# EAGLE design Tuesday(MelodyR2-smtleds) (EAGLE 6.5.0)
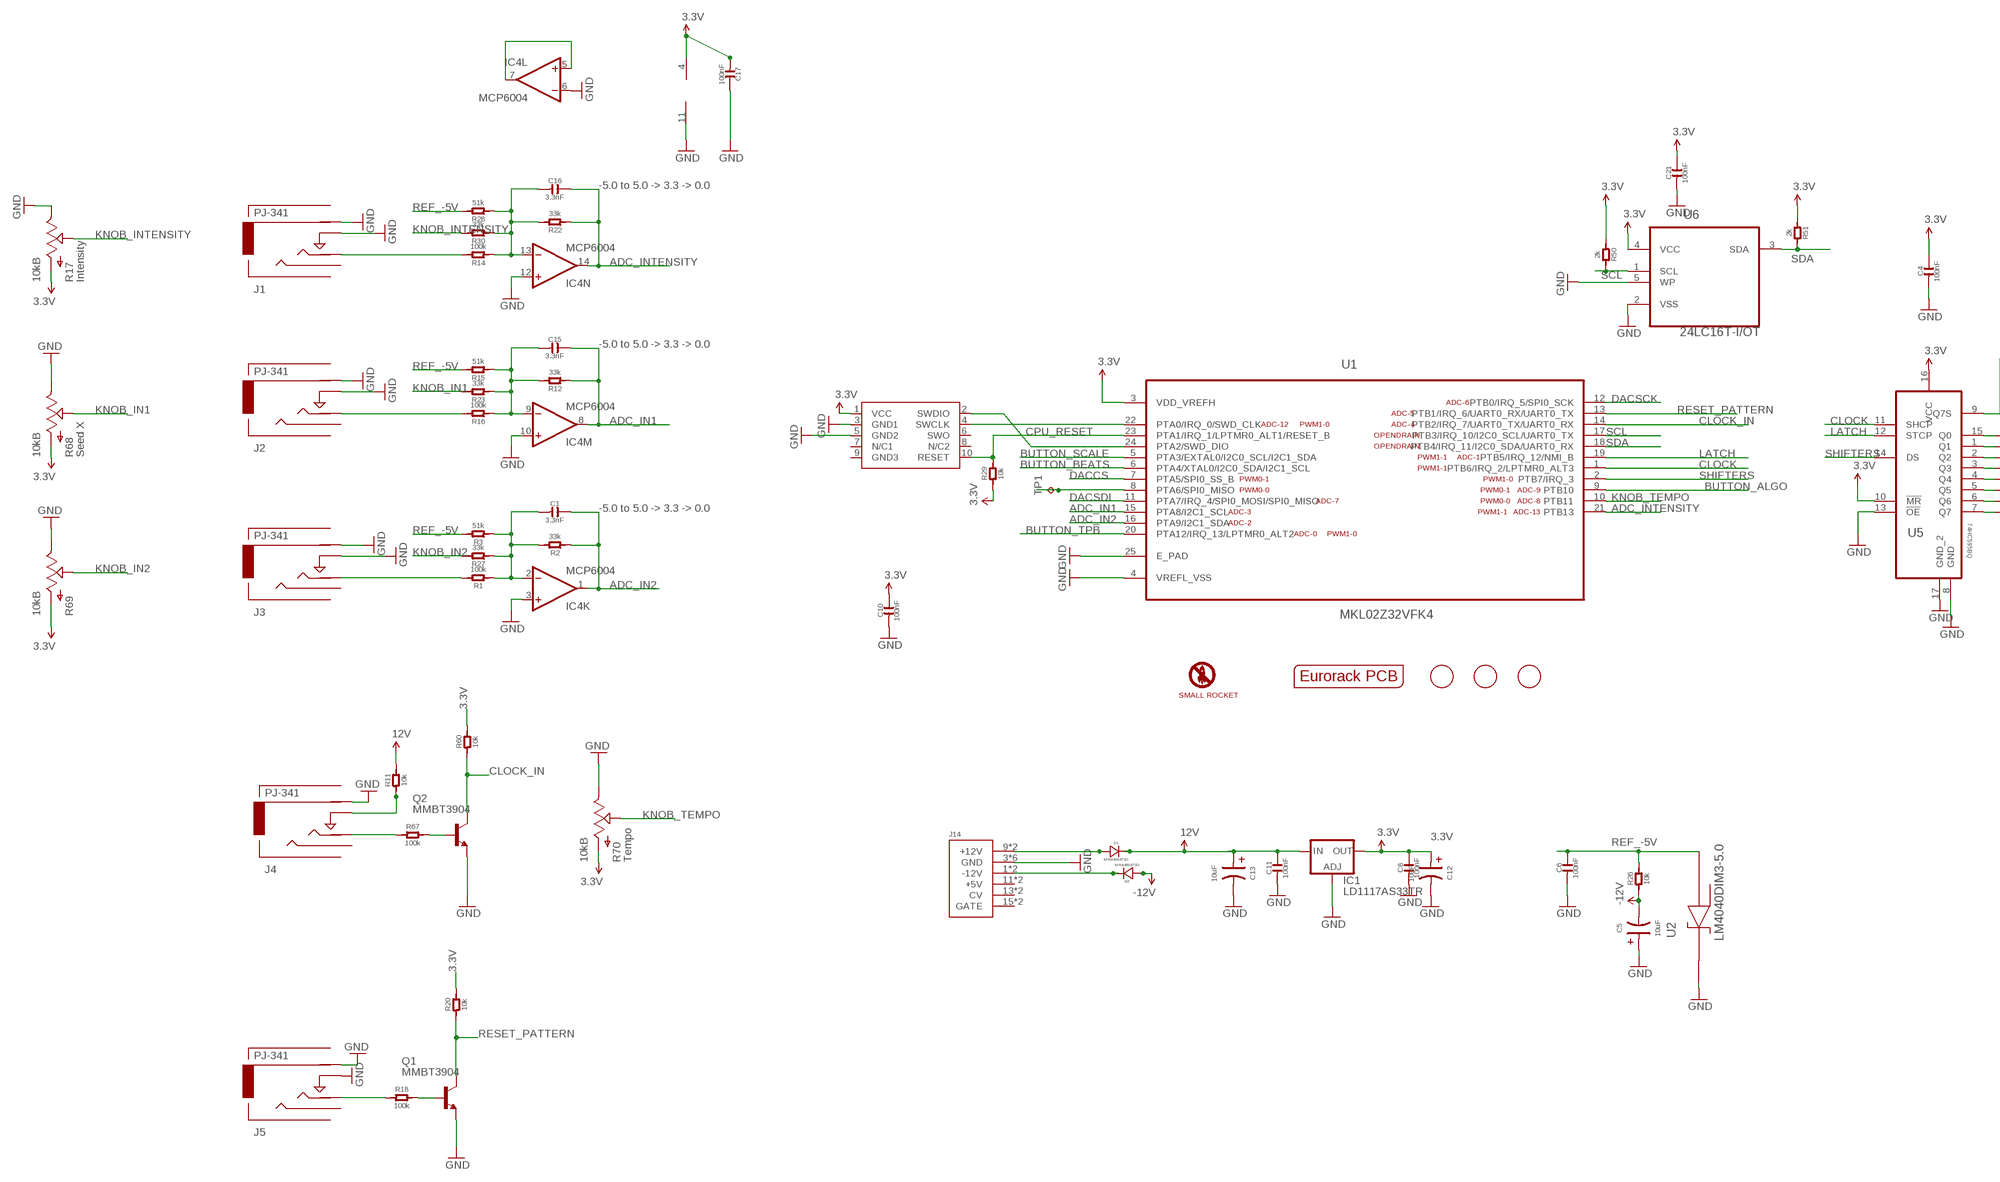
[diagram p0: schematic, sheet 1, part 1 of 2]
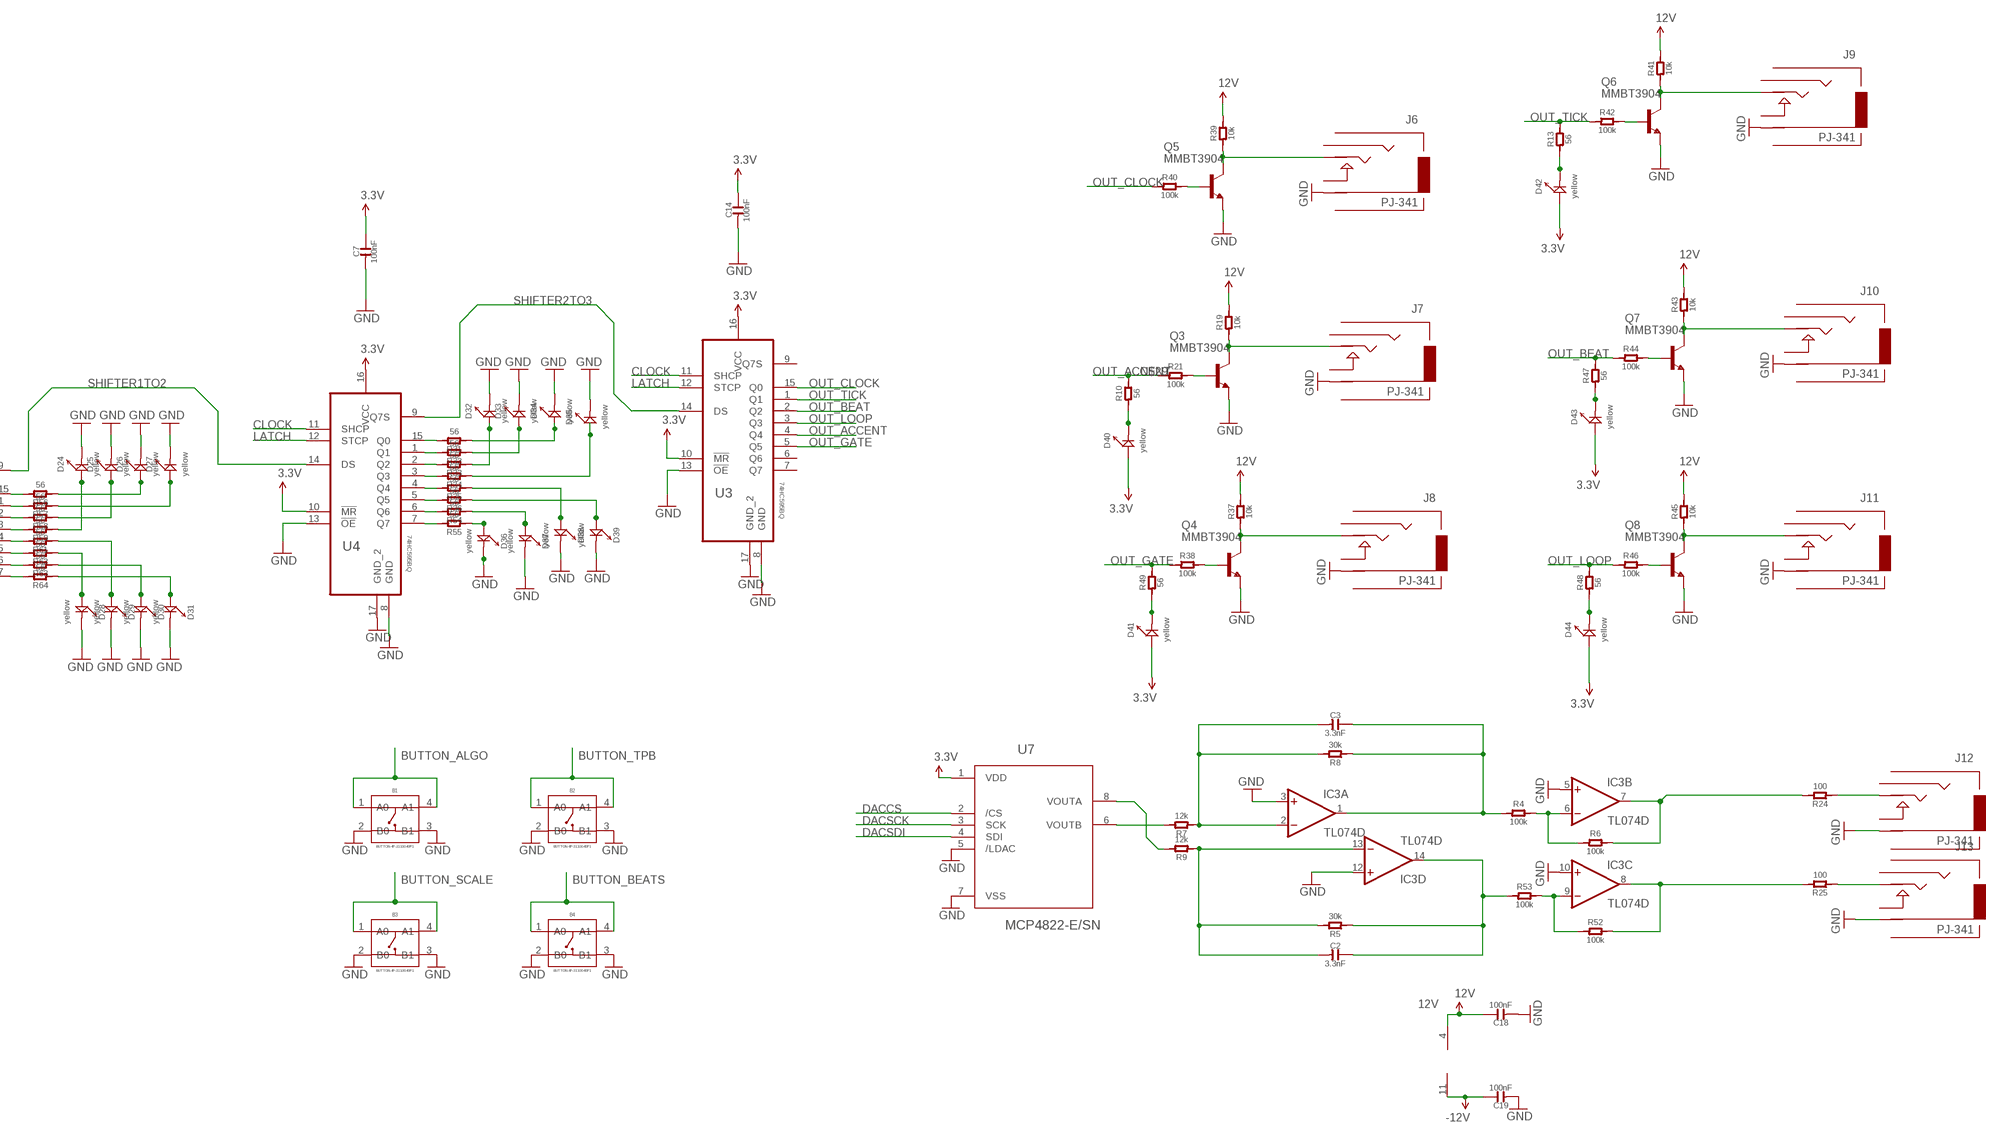
[diagram p1: schematic, sheet 1, part 2 of 2]

## Parts
B1  BUTTON-4P-3110040P1  [4P-6.0X6.0X5.0H]
B2  BUTTON-4P-3110040P1  [4P-6.0X6.0X5.0H]
B3  BUTTON-4P-3110040P1  [4P-6.0X6.0X5.0H]
B4  BUTTON-4P-3110040P1  [4P-6.0X6.0X5.0H]
C1  3.3nF  C-0603  [C0603]
C2  3.3nF  C-0603  [C0603]
C3  3.3nF  C-0603  [C0603]
C4  100nF  C-0603  [C0603]
C5  10uF  C-POLAR-A  [AVX-A]
C6  100nF  C-0603  [C0603]
C7  100nF  C-0603  [C0603]
C8  100nF  C-0603  [C0603]
C10  100nF  C-0603  [C0603]
C11  100nF  C-0603  [C0603]
C12  10uF  C-POLAR-A  [AVX-A]
C13  10uF  C-POLAR-A  [AVX-A]
C14  100nF  C-0603  [C0603]
C15  3.3nF  C-0603  [C0603]
C16  3.3nF  C-0603  [C0603]
C17  100nF  C-0603  [C0603]
C18  100nF  C-0603  [C0603]
C19  100nF  C-0603  [C0603]
C21  100nF  C-0603  [C0603]
D1  MRA4004T3G  D-SMA  [DO-214AC]
D2  MRA4004T3G  D-SMA  [DO-214AC]
D24  yellow  LED  [LED0603]
D25  yellow  LED  [LED0603]
D26  yellow  LED  [LED0603]
D27  yellow  LED  [LED0603]
D28  yellow  LED  [LED0603]
D29  yellow  LED  [LED0603]
D30  yellow  LED  [LED0603]
D31  yellow  LED  [LED0603]
D32  yellow  LED  [LED0603]
D33  yellow  LED  [LED0603]
D34  yellow  LED  [LED0603]
D35  yellow  LED  [LED0603]
D36  yellow  LED  [LED0603]
D37  yellow  LED  [LED0603]
D38  yellow  LED  [LED0603]
D39  yellow  LED  [LED0603]
D40  yellow  LED  [LED0603]
D41  yellow  LED  [LED0603]
D42  yellow  LED  [LED0603]
D43  yellow  LED  [LED0603]
D44  yellow  LED  [LED0603]
FID1  FIDUCIAL  [FIDUCIAL_1MM]
FID2  FIDUCIAL  [FIDUCIAL_1MM]
FID3  FIDUCIAL  [FIDUCIAL_1MM]
IC1  LD1117AS33TR  [SOT223]
IC3  TL074D  [SO14]
IC4  MCP6004  [SO14]
J1  PJ-341  AUDIO-JACKINPUT  [3.5MM-JACK-SWITCH-13MM-INPUT]
J2  PJ-341  AUDIO-JACKINPUT  [3.5MM-JACK-SWITCH-13MM-INPUT]
J3  PJ-341  AUDIO-JACKINPUT  [3.5MM-JACK-SWITCH-13MM-INPUT]
J4  PJ-341  AUDIO-JACKINPUT  [3.5MM-JACK-SWITCH-13MM-INPUT]
J5  PJ-341  AUDIO-JACKINPUT  [3.5MM-JACK-SWITCH-13MM-INPUT]
J6  PJ-341  AUDIO-JACKOUTPUT  [3.5MM-JACK-SWITCH-13MM-OUTPUT]
J7  PJ-341  AUDIO-JACKOUTPUT  [3.5MM-JACK-SWITCH-13MM-OUTPUT]
J8  PJ-341  AUDIO-JACKOUTPUT  [3.5MM-JACK-SWITCH-13MM-OUTPUT]
J9  PJ-341  AUDIO-JACKOUTPUT  [3.5MM-JACK-SWITCH-13MM-OUTPUT]
J10  PJ-341  AUDIO-JACKOUTPUT  [3.5MM-JACK-SWITCH-13MM-OUTPUT]
J11  PJ-341  AUDIO-JACKOUTPUT  [3.5MM-JACK-SWITCH-13MM-OUTPUT]
J12  PJ-341  AUDIO-JACKOUTPUT  [3.5MM-JACK-SWITCH-13MM-OUTPUT]
J13  PJ-341  AUDIO-JACKOUTPUT  [3.5MM-JACK-SWITCH-13MM-OUTPUT]
J14  POWER  [POWER_16]
OUTLINE  EURORACK_PCB12HP  [EURORACK12HPPCB]
PRETTY1  SMALLROCKET  [SMALLROCKET]
Q1  MMBT3904  MMBT3904LT1-NPN-SOT23-BEC  [SOT23-BEC]
Q2  MMBT3904  MMBT3904LT1-NPN-SOT23-BEC  [SOT23-BEC]
Q3  MMBT3904  MMBT3904LT1-NPN-SOT23-BEC  [SOT23-BEC]
Q4  MMBT3904  MMBT3904LT1-NPN-SOT23-BEC  [SOT23-BEC]
Q5  MMBT3904  MMBT3904LT1-NPN-SOT23-BEC  [SOT23-BEC]
Q6  MMBT3904  MMBT3904LT1-NPN-SOT23-BEC  [SOT23-BEC]
Q7  MMBT3904  MMBT3904LT1-NPN-SOT23-BEC  [SOT23-BEC]
Q8  MMBT3904  MMBT3904LT1-NPN-SOT23-BEC  [SOT23-BEC]
R1  100k  R-0603  [R0603]
R2  33k  R-0603  [R0603]
R3  51k  R-0603  [R0603]
R4  100k  R-0603  [R0603]
R5  30k  R-0603  [R0603]
R6  100k  R-0603  [R0603]
R7  12k  R-0603  [R0603]
R8  30k  R-0603  [R0603]
R9  12k  R-0603  [R0603]
R10  56  R-0603  [R0603]
R11  10k  R-0603  [R0603]
R12  33k  R-0603  [R0603]
R13  56  R-0603  [R0603]
R14  100k  R-0603  [R0603]
R15  51k  R-0603  [R0603]
R16  100k  R-0603  [R0603]
R17  10kB  POTZEPHPOT  [OG-POTS_ALPS_POT_VERTICAL]
R18  100k  R-0603  [R0603]
R19  10k  R-0603  [R0603]
R20  10k  R-0603  [R0603]
R21  100k  R-0603  [R0603]
R22  33k  R-0603  [R0603]
R23  33k  R-0603  [R0603]
R24  100  R-0603  [R0603]
R25  100  R-0603  [R0603]
R26  10k  R-0603  [R0603]
R27  33k  R-0603  [R0603]
R28  51k  R-0603  [R0603]
R29  10k  R-0603  [R0603]
R30  33k  R-0603  [R0603]
R31  56  R-0603  [R0603]
R32  56  R-0603  [R0603]
R33  56  R-0603  [R0603]
R34  56  R-0603  [R0603]
R35  56  R-0603  [R0603]
R36  56  R-0603  [R0603]
R37  10k  R-0603  [R0603]
R38  100k  R-0603  [R0603]
R39  10k  R-0603  [R0603]
R40  100k  R-0603  [R0603]
R41  10k  R-0603  [R0603]
R42  100k  R-0603  [R0603]
R43  10k  R-0603  [R0603]
R44  100k  R-0603  [R0603]
R45  10k  R-0603  [R0603]
R46  100k  R-0603  [R0603]
R47  56  R-0603  [R0603]
R48  56  R-0603  [R0603]
R49  56  R-0603  [R0603]
R50  2k  R-0603  [R0603]
R51  2k  R-0603  [R0603]
R52  100k  R-0603  [R0603]
R53  100k  R-0603  [R0603]
R54  56  R-0603  [R0603]
R55  56  R-0603  [R0603]
R56  56  R-0603  [R0603]
R57  56  R-0603  [R0603]
R58  56  R-0603  [R0603]
R59  56  R-0603  [R0603]
R60  10k  R-0603  [R0603]
R61  56  R-0603  [R0603]
R62  56  R-0603  [R0603]
R63  56  R-0603  [R0603]
R64  56  R-0603  [R0603]
R67  100k  R-0603  [R0603]
R68  10kB  POTZEPHPOT  [OG-POTS_ALPS_POT_VERTICAL]
R69  10kB  POTZEPHPOT  [OG-POTS_ALPS_POT_VERTICAL]
R70  10kB  POTZEPHPOT  [OG-POTS_ALPS_POT_VERTICAL]
SWD1  CORTEX_SWD  [M50-3600542]
TP1  TPB1,27  [B1,27]
U1  MKL02Z32VFK4  [QFN50P400X400X100-25N]
U2  LM4040DIM3-5.0  [SOT95P237X112-3N]
U3  74HC595BQ  [QFN50P250X350X100-17N]
U4  74HC595BQ  [QFN50P250X350X100-17N]
U5  74HC595BQ  [QFN50P250X350X100-17N]
U6  24LC16T-I/OT  24LC00T-I/OT  [SOT95P290X145-5N]
U7  MCP4822-E/SN  [SOIC8-N_MC]

## Nets
3.3V [mediumpower]: C4.2 C7.2 C8.2 C10.2 C12.+ C14.2 C17.1 C21.2 D40.+ D41.+ D42.+ D43.+ D44.+ IC1.2(OUT) IC1.4(OUT) IC4.4(O:V+) R17.P$3(A) R20.2 R29.1 R50.1 R51.1 R60.2 R68.P$3(A) R69.P$3(A) R70.P$3(A) SWD1.1(VCC) U1.3(VDD_VREFH) U3.10(!MR) U3.16(VCC) U4.10(!MR) U4.16(VCC) U5.10(!MR) U5.16(VCC) U6.4(VCC) U7.1(VDD)
12V [heavypower]: C11.2 C13.+ C18.2 D1.2(-) IC1.3(IN) IC3.4(P:V+) R11.2 R19.2 R37.2 R39.2 R41.2 R43.2 R45.2
-12V [heavypower]: C5.- C19.2 D2.1(+) IC3.11(P:V-) R26.1
ADC_IN1: C15.2 IC4.8(M:OUT) R12.1 U1.15(PTA8/I2C1_SCL)
ADC_IN2: C1.2 IC4.1(K:OUT) R2.1 U1.16(PTA9/I2C1_SDA)
ADC_INTENSITY: C16.2 IC4.14(N:OUT) R22.1 U1.21(PTB13)
BUTTON_ALGO: B1.1(A0) B1.4(A1) U1.9(PTB10)
BUTTON_BEATS: B4.1(A0) B4.4(A1) U1.6(PTA4/XTAL0/I2C0_SDA/I2C1_SCL)
BUTTON_SCALE: B3.1(A0) B3.4(A1) U1.5(PTA3/EXTAL0/I2C0_SCL/I2C1_SDA)
BUTTON_TPB: B2.1(A0) B2.4(A1) U1.20(PTA12/IRQ_13/LPTMR0_ALT2)
CLOCK: U1.1(PTB6/IRQ_2/LPTMR0_ALT3) U3.11(SHCP) U4.11(SHCP) U5.11(SHCP)
CLOCK_IN: Q2.C R60.1 U1.14(PTB2/IRQ_7/UART0_TX/UART0_RX)
CPU_RESET: R29.2 SWD1.10(RESET) U1.23(PTA1/IRQ_1/LPTMR0_ALT1/RESET_B)
D21: D43.- R47.1
DACCS: U1.7(PTA5/SPI0_SS_B) U7.2(/CS)
DACSCK: U1.12(PTB0/IRQ_5/SPI0_SCK) U7.3(SCK)
DACSDI: U1.11(PTA7/IRQ_4/SPI0_MOSI/SPI0_MISO) U7.4(SDI)
GND [groundplane]: B1.2(B0) B1.3(B1) B2.2(B0) B2.3(B1) B3.2(B0) B3.3(B1) B4.2(B0) B4.3(B1) C4.1 C5.+ C6.1 C7.1 C8.1 C10.1 C11.1 C12.- C13.- C14.1 C17.2 C18.1 C19.1 C21.1 D24.- D25.- D26.- D27.- D28.- D29.- D30.- D31.- D32.- D33.- D34.- D35.- D36.- D37.- D38.- D39.- IC1.1(ADJ) IC3.3(A:+IN) IC3.5(B:+IN) IC3.10(C:+IN) IC3.12(D:+IN) IC4.3(K:+IN) IC4.6(L:-IN) IC4.10(M:+IN) IC4.11(O:V-) IC4.12(N:+IN) J1.RING@3(RING) J1.SWITCH@3(SWITCH) J2.RING@3(RING) J2.SWITCH@3(SWITCH) J3.RING@3(RING) J3.SWITCH@3(SWITCH) J4.RING@3(RING) J5.RING@3(RING) J5.SWITCH@3(SWITCH) J6.RING@3(RING) J7.RING@3(RING) J8.RING@3(RING) J9.RING@3(RING) J10.RING@3(RING) J11.RING@3(RING) J12.RING@3(RING) J13.RING@3(RING) J14.3(GND) J14.4(GND) J14.5(GND) J14.6(GND) J14.7(GND) J14.8(GND) Q1.E Q2.E Q3.E Q4.E Q5.E Q6.E Q7.E Q8.E R17.P$1(E) R68.P$1(E) R69.P$1(E) R70.P$1(E) SWD1.3(GND1) SWD1.5(GND2) U1.4(VREFL_VSS) U1.25(E_PAD) U2.1(CATHODE) U3.8(GND) U3.13(!OE) U3.17(GND_2) U4.8(GND) U4.13(!OE) U4.17(GND_2) U5.8(GND) U5.13(!OE) U5.17(GND_2) U6.2(VSS) U6.5(WP) U7.5(/LDAC) U7.7(VSS)
KNOB_IN1: R23.2 R68.P$2(S)
KNOB_IN2: R27.2 R69.P$2(S)
KNOB_INTENSITY: R17.P$2(S) R30.2
KNOB_TEMPO: R70.P$2(S) U1.10(PTB11)
LATCH: U1.19(PTB5/IRQ_12/NMI_B) U3.12(STCP) U4.12(STCP) U5.12(STCP)
N$1: R32.2 U4.1(Q1)
N$2: IC3.6(B:-IN) R4.2 R6.1
N$3: J2.TIP@3(TIP) R16.2
N$4: C15.1 IC4.9(M:-IN) R12.2 R15.1 R16.1 R23.1
N$5: R9.2 U7.8(VOUTA)
N$6: J3.TIP@3(TIP) R1.2
N$7: R7.2 U7.6(VOUTB)
N$8: C1.1 IC4.2(K:-IN) R1.1 R2.2 R3.1 R27.1
N$9: C2.1 IC3.13(D:-IN) R5.2 R9.1
N$10: C3.1 IC3.2(A:-IN) R7.1 R8.2
N$12: D42.- R13.1
N$13 [heavypower]: D1.1(+) J14.9(+12V) J14.10(+12V)
N$14: IC3.7(B:OUT) R6.2 R24.2
N$15: Q1.B R18.2
N$16: J5.TIP@3(TIP) R18.1
N$17: IC3.9(C:-IN) R52.1 R53.2
N$18: C3.2 IC3.1(A:OUT) R4.1 R8.1
N$19: R33.2 U4.2(Q2)
N$20: J13.TIP@3(TIP) R25.1
N$21: J12.TIP@3(TIP) R24.1
N$23: D40.- R10.1
N$24: C2.2 IC3.14(D:OUT) R5.1 R53.1
N$25: Q3.B R21.2
N$26: R34.2 U4.3(Q3)
N$27: R35.2 U4.4(Q4)
N$28: D28.+ R62.1
N$29: J7.TIP@3(TIP) Q3.C R19.1
N$30: R36.2 U4.5(Q5)
N$31: R54.2 U4.6(Q6)
N$32: D29.+ R61.1
N$33: J1.TIP@3(TIP) R14.2
N$34: C16.1 IC4.13(N:-IN) R14.1 R22.2 R28.1 R30.1
N$35: R55.2 U4.7(Q7)
N$36: R31.2 U4.15(Q0)
N$37: R56.2 U5.15(Q0)
N$38: R57.2 U5.1(Q1)
N$39: R58.2 U5.2(Q2)
N$40: R59.2 U5.3(Q3)
N$41: R61.2 U5.4(Q4)
N$42: R62.2 U5.5(Q5)
N$43: J4.TIP@3(TIP) R67.1
N$44: D41.- R49.1
N$45: D44.- R48.1
N$48: R63.2 U5.6(Q6)
N$49: R64.2 U5.7(Q7)
N$57: Q4.B R38.2
N$58: J8.TIP@3(TIP) Q4.C R37.1
N$60: Q5.B R40.2
N$61: J6.TIP@3(TIP) Q5.C R39.1
N$63: Q6.B R42.2
N$64 [heavypower]: D2.2(-) J14.1(-12V) J14.2(-12V)
N$65: J9.TIP@3(TIP) Q6.C R41.1
N$66: Q2.B R67.2
N$68: Q7.B R44.2
N$69: J10.TIP@3(TIP) Q7.C R43.1
N$71: Q8.B R46.2
N$72: J11.TIP@3(TIP) Q8.C R45.1
N$73: D27.+ R57.1
N$74: D26.+ R56.1
N$75: D25.+ R58.1
N$76: D24.+ R59.1
N$77: D30.+ R63.1
N$78: D31.+ R64.1
N$79: D32.+ R33.1
N$80: D33.+ R32.1
N$81: D34.+ R31.1
N$82: D35.+ R34.1
N$83: D36.+ R55.1
N$84: D37.+ R54.1
N$85: D38.+ R35.1
N$86: D39.+ R36.1
N$94: IC3.8(C:OUT) R25.2 R52.2
N$96: J4.SWITCH@3(SWITCH) R11.1
N$97: IC4.5(L:+IN) IC4.7(L:OUT)
OUT_ACCENT: R10.2 R21.1 U3.4(Q4)
OUT_BEAT: R44.1 R47.2 U3.2(Q2)
OUT_CLOCK: R40.1 U3.15(Q0)
OUT_GATE: R38.1 R49.2 U3.5(Q5)
OUT_LOOP: R46.1 R48.2 U3.3(Q3)
OUT_TICK: R13.2 R42.1 U3.1(Q1)
PTA6: TP1.TP U1.8(PTA6/SPI0_MISO)
REF_-5V: C6.2 R3.2 R15.2 R26.2 R28.2 U2.2(ANODE)
RESET_PATTERN: Q1.C R20.1 U1.13(PTB1/IRQ_6/UART0_RX/UART0_TX)
SCL: R50.2 U1.17(PTB3/IRQ_10/I2C0_SCL/UART0_TX) U6.1(SCL)
SDA: R51.2 U1.18(PTB4/IRQ_11/I2C0_SDA/UART0_RX) U6.3(SDA)
SHIFTER1TO2: U4.14(DS) U5.9(Q7S)
SHIFTER2TO3: U3.14(DS) U4.9(Q7S)
SHIFTERS: U1.2(PTB7/IRQ_3) U5.14(DS)
SWD_CLK: SWD1.4(SWCLK) U1.22(PTA0/IRQ_0/SWD_CLK)
SWD_DIO: SWD1.2(SWDIO) U1.24(PTA2/SWD_DIO)
Unconnected: J1.SECOND@3(SECOND) J2.SECOND@3(SECOND) J3.SECOND@3(SECOND) J4.SECOND@3(SECOND) J5.SECOND@3(SECOND) J6.SECOND@3(SECOND) J6.SWITCH@3(SWITCH) J7.SECOND@3(SECOND) J7.SWITCH@3(SWITCH) J8.SECOND@3(SECOND) J8.SWITCH@3(SWITCH) J9.SECOND@3(SECOND) J9.SWITCH@3(SWITCH) J10.SECOND@3(SECOND) J10.SWITCH@3(SWITCH) J11.SECOND@3(SECOND) J11.SWITCH@3(SWITCH) J12.SECOND@3(SECOND) J12.SWITCH@3(SWITCH) J13.SECOND@3(SECOND) J13.SWITCH@3(SWITCH) J14.11(+5V) J14.12(+5V) J14.13(CV) J14.14(CV) J14.15(GATE) J14.16(GATE) SWD1.6(SWO) SWD1.7(N/C1) SWD1.8(N/C2) SWD1.9(GND3) U2.3(NC) U3.6(Q6) U3.7(Q7) U3.9(Q7S)

## Notes on the sheet
- -5.0 to 5.0 -> 3.3 -> 0.0
- -5.0 to 5.0 -> 3.3 -> 0.0
- -5.0 to 5.0 -> 3.3 -> 0.0

## Library data of the parts
B1 = zephod-components:BUTTON-4P; DESC: Algorithm; OC_FARNELL: unknown
B2 = zephod-components:BUTTON-4P; DESC: Ticks; OC_FARNELL: unknown
B3 = zephod-components:BUTTON-4P; DESC: Scale; OC_FARNELL: unknown
B4 = zephod-components:BUTTON-4P; DESC: Beats; OC_FARNELL: unknown
C1-C3 C15 C16 = OPL:C*; OC_FARNELL: unknown
C4 C7 C8 C10 C11 C14 C17-C19 C21 = OPL:C*; MF: MULTICOMP; MPN: MC0603F104Z160CT; OC_FARNELL: 1759017
C5 C12 C13 = OPL:C-POLAR*; MF: AVX; MPN: TAJB106K020RNJ; OC_FARNELL: 197427
C6 = OPL:C*; MF: AVX; MPN: 06035C104KAT2A; OC_FARNELL: 1301804
D1 D2 = OPL:D*: DIODE; MF: VISHAY; MPN: US1G-E3/5AT; OC_FARNELL: 9551824
D24-D44 = OPL:LED*: LED
FID1-FID3 = adafruit:FIDUCIAL: For use by pick and place machines to calibrate the vision/machine, 1mm By microbuilder.eu; OC_FARNELL: unknown
IC1 = ld-components:LD1117A?*: Low drop fixed and adjustable positive voltage regulators 1 A Source: http://www.st.com/stonline/products/literature/ds/7194/ld1117axx.pdf; MF: STMICROELECTRONICS; MPN: LD1117AS33TR; OC_FARNELL: 1467776
IC3 = EurorackModularParts:TL074: OP AMP; MF: TEXAS INSTRUMENTS; MPN: TL074CD; OC_FARNELL: 1103010
IC4 = EurorackModularParts:MCP6004; MF: MICROCHIP; MPN: MCP6004-I/SL.; OC_FARNELL: 1605572
J1 = EurorackModularParts:AUDIO-JACK: Switching Mono 3.5mm Audio Jack from Erthenvar.; DESC: Intensity; OC_FARNELL: unknown
J2 = EurorackModularParts:AUDIO-JACK: Switching Mono 3.5mm Audio Jack from Erthenvar.; DESC: Seed X; OC_FARNELL: unknown
J3 = EurorackModularParts:AUDIO-JACK: Switching Mono 3.5mm Audio Jack from Erthenvar.; DESC: Seed Y; OC_FARNELL: unknown
J4 = EurorackModularParts:AUDIO-JACK: Switching Mono 3.5mm Audio Jack from Erthenvar.; DESC: Clock; OC_FARNELL: unknown
J5 = EurorackModularParts:AUDIO-JACK: Switching Mono 3.5mm Audio Jack from Erthenvar.; DESC: Reset; OC_FARNELL: unknown
J6 = EurorackModularParts:AUDIO-JACK: Switching Mono 3.5mm Audio Jack from Erthenvar.; DESC: Clock Out; OC_FARNELL: unknown
J7 = EurorackModularParts:AUDIO-JACK: Switching Mono 3.5mm Audio Jack from Erthenvar.; DESC: Accent; OC_FARNELL: unknown
J8 = EurorackModularParts:AUDIO-JACK: Switching Mono 3.5mm Audio Jack from Erthenvar.; DESC: Gate; OC_FARNELL: unknown
J9 = EurorackModularParts:AUDIO-JACK: Switching Mono 3.5mm Audio Jack from Erthenvar.; DESC: Tick; OC_FARNELL: unknown
J10 = EurorackModularParts:AUDIO-JACK: Switching Mono 3.5mm Audio Jack from Erthenvar.; DESC: Beat; OC_FARNELL: unknown
J11 = EurorackModularParts:AUDIO-JACK: Switching Mono 3.5mm Audio Jack from Erthenvar.; DESC: Loop; OC_FARNELL: unknown
J12 = EurorackModularParts:AUDIO-JACK: Switching Mono 3.5mm Audio Jack from Erthenvar.; DESC: Note; OC_FARNELL: unknown
J13 = EurorackModularParts:AUDIO-JACK: Switching Mono 3.5mm Audio Jack from Erthenvar.; DESC: Velocity; OC_FARNELL: unknown
J14 = eurorack:POWER; OC_FARNELL: unknown
OUTLINE = EurorackModularParts:EURORACK_PCB; OC_FARNELL: unknown
PRETTY1 = zephod-components:SMALLROCKET; OC_FARNELL: unknown
Q1-Q8 = transistor:*-NPN-: NPN Transistror BF959 corrected 2008.03.06; MF: NXP; MPN: PMBT3904,215; OC_FARNELL: 2336795
R1-R16 R18-R64 R67 = OPL:R*; OC_FARNELL: unknown
R17 = EurorackModularParts:POT; DESC: Intensity; OC_FARNELL: unknown
R68 = EurorackModularParts:POT; DESC: Seed X; OC_FARNELL: unknown
R69 = EurorackModularParts:POT; DESC: Seed Y; OC_FARNELL: unknown
R70 = EurorackModularParts:POT; DESC: Tempo; OC_FARNELL: unknown
SWD1 = carrilib with jtags:CORTEX_SWD: .05" Cortex M Connector in SWD mode Manufacturer: Generic Part Number: Cortex M SWD Notes: I use Harwin M50-3600542 connectors; OC_FARNELL: unknown
TP1 = testpad:TP: Test pad; OC_FARNELL: unknown
U1 = FarnellThings:MKL02Z32VFK4: IC, MCU, 32BIT, CORTEX M0+, 48MHZ, QFN-24; MF: NXP; MPN: MKL02Z32VFK4; OC_FARNELL: 2321481; OC_NEWARK: 61W9887; PACKAGE: QFN-24; SUPPLIER: FREESCALE SEMICONDUCTOR
U2 = FarnellThings:LM4040DIM3-5.0: IC, Precision Micropower Shunt Voltage Reference, 5V,SOT-23-3; MF: TEXAS INSTRUMENTS; MPN: LM4040DIM3-5.0; OC_FARNELL: 9778330; OC_NEWARK: 97K3489; PACKAGE: SOT-23-3; SUPPLIER: TEXAS INSTRUMENTS
U3-U5 = FarnellThings:74HC595BQ: 8-bit serial-in, serial or parallel-out shift register,QFN-16; MF: NXP; MPN: 74HC595BQ; OC_FARNELL: 2164850; OC_NEWARK: 43W8000; PACKAGE: QFN-16; SUPPLIER: NXP
U6 = EurorackModularParts:24LC00T-I/OT: IC, EEPROM 128BIT SERIAL 400KHZ SOT-23-5; MF: MICROCHIP; MPN: 24LC00T-I/OT; OC_FARNELL: 9757864; OC_NEWARK: 62K0574; PACKAGE: SOT-23-5; SUPPLIER: MICROCHIP
U7 = FarnellThings:MCP4822-E/SN: 12 Bit DAC; DESCRIPTION: 12 Bit DAC; MF: MICROCHIP; MPN: MCP4822-E/SN; OC_FARNELL: 1439414; OC_NEWARK: 31K2975; PACKAGE: SOIC-8; SUPPLIER: Microchip

## Net classes
0 default: width 0.203 mm, clearance 0.178 mm
1 heavypower: width 0.381 mm
2 mediumpower: width 0.254 mm
3 groundplane: width 0.254 mm, clearance 0.203 mm

## Board
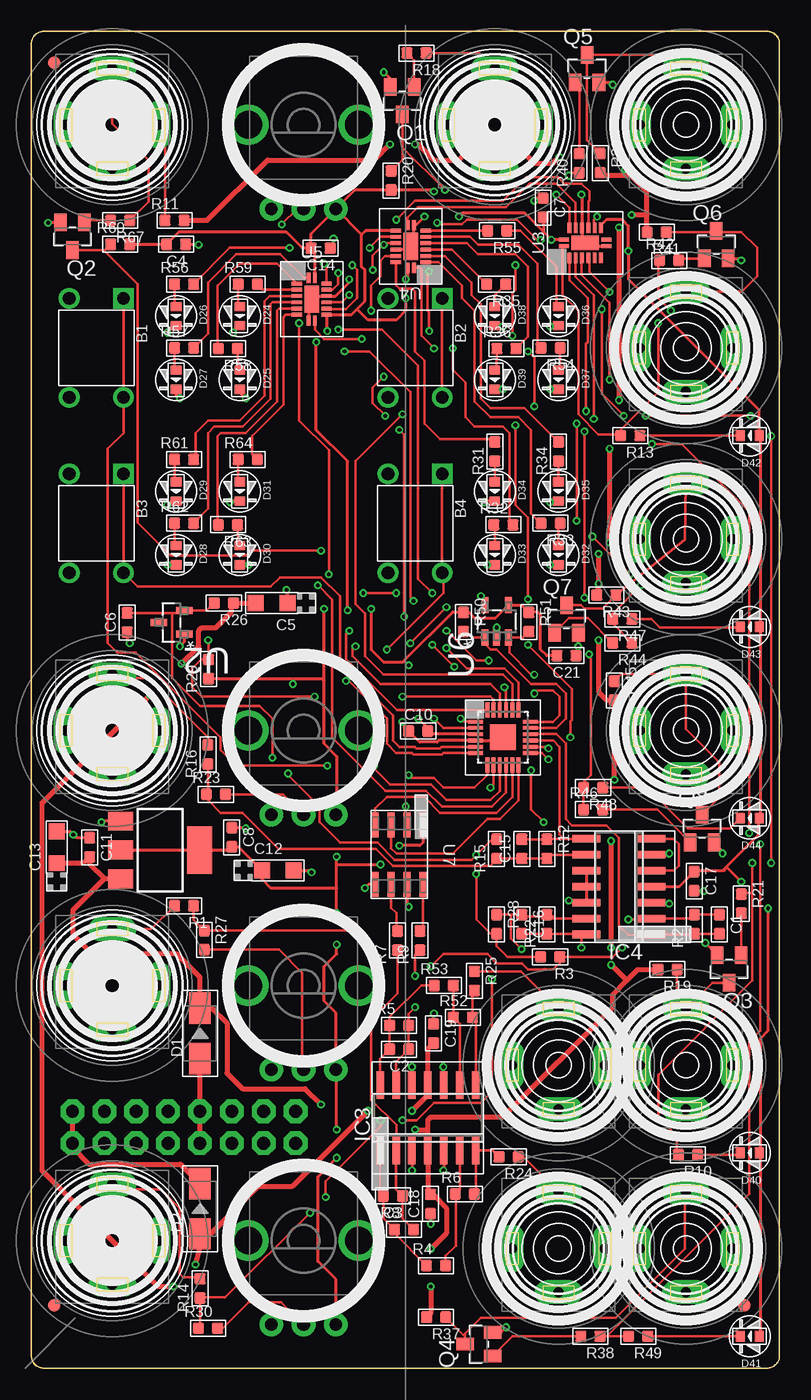
[diagram p2: board, top side]
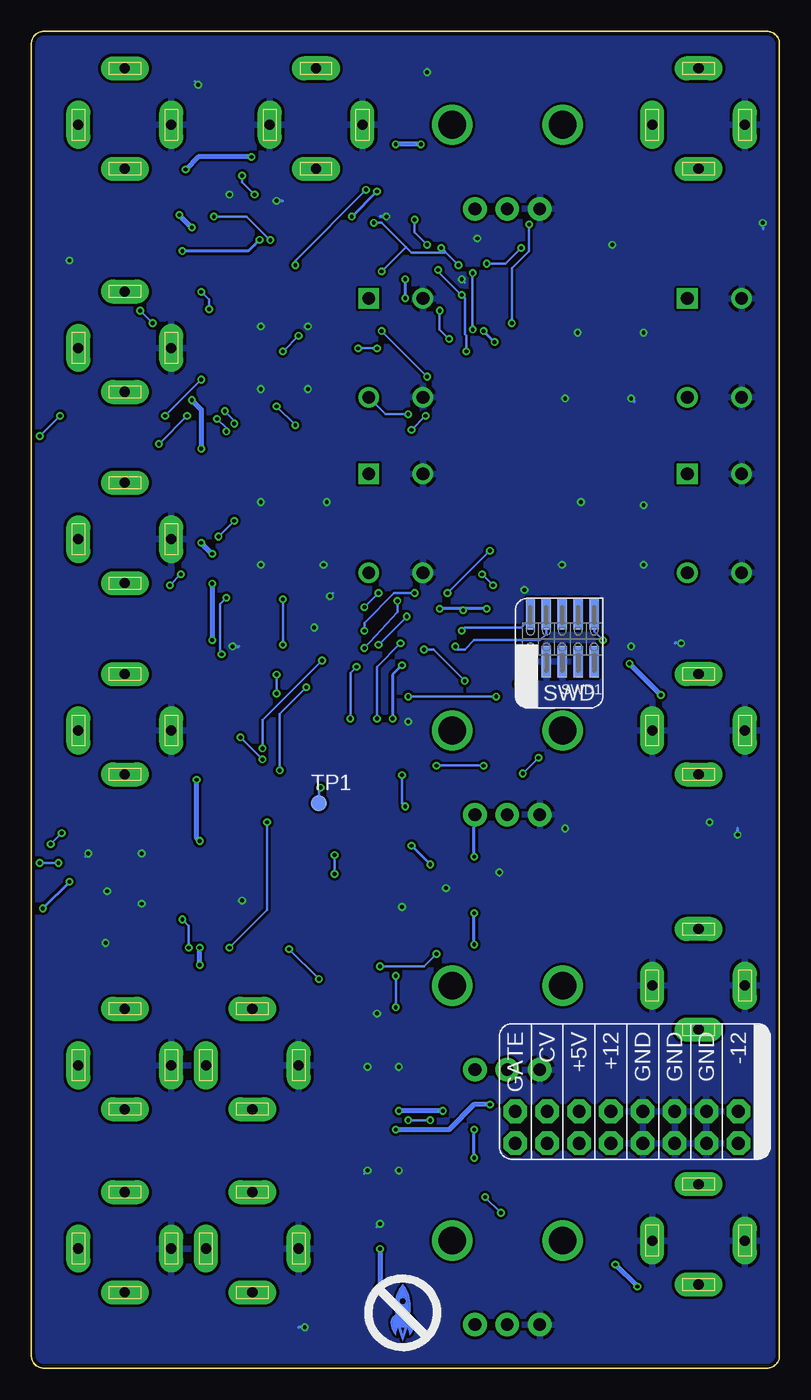
[diagram p3: board, bottom side, seen from below]

Size 59.62 x 106.5 mm. Coordinates in mm from the lower left corner, seen from the top.
Copper layers (1*16): Top 0.035mm / dielectric 1.5mm / Bottom 0.035mm
Design rules "dirt_cheap_dirty_boards.v1": minimum track width 5mil, minimum drill 12mil, track to track 5mil, track to pad 5mil, pad to pad 5mil, via to via 5mil, smd to smd 0mil, copper to edge 10mil, drill to drill 10mil, minimum pad ring 10mil, minimum via ring 6mil, stop-mask expansion 2mil, vias tented up to drill 25mil, thermal gap 10mil

### Footprints (pad centres in the part's own frame; a part is rotated, then mirrored left to right if it is on the bottom)
4P-6.0X6.0X5.0H = drill 1.016 pad 1.651 square: 1 -3.937,2.159 | drill 1.016 pad 1.651: 2 -3.937,-2.159; 3 3.937,-2.159; 4 3.937,2.159
C0603 = smd 0.889 x 0.889: 1 -0.762,0; 2 0.762,0
AVX-A = smd 1.27 x 1.27: + -1.27,0; - 1.27,0
DO-214AC = smd 2.5 x 1.7: 1 -2,0; 2 2,0
LED0603 = smd 0.762 x 0.889: + -0.762,0; - 0.762,0
FIDUCIAL_1MM = smd 1 x 1: 1 0,0
SOT223 = smd 1.5 x 2: 1 -2.3,-3.15; 2 0,-3.15; 3 2.3,-3.15 | smd 3.8 x 2: 4 0,3.15
SO14 = smd 0.6 x 2.2: 1 -3.81,-2.6; 2 -2.54,-2.6; 3 -1.27,-2.6; 4 0,-2.6; 5 1.27,-2.6; 6 2.54,-2.6; 7 3.81,-2.6; 8 3.81,2.6; 9 2.54,2.6; 10 1.27,2.6; 11 0,2.6; 12 -1.27,2.6; 13 -2.54,2.6; 14 -3.81,2.6
3.5MM-JACK-SWITCH-13MM-INPUT = drill 0.8 pad 1.93 long: RING@3 -3.7,0; SECOND@3 0,-3.5; SWITCH@3 3.7,0; TIP@3 0,4.5
3.5MM-JACK-SWITCH-13MM-OUTPUT = drill 0.8 pad 1.93 long: RING@3 -3.7,0; SECOND@3 0,-3.5; SWITCH@3 3.7,0; TIP@3 0,4.5
POWER_16 = drill 1.016 pad 1.88 octagon: 1 -6.35,-1.27; 2 -6.35,1.27; 3 -3.81,-1.27; 4 -3.81,1.27; 5 -1.27,-1.27; 6 -1.27,1.27; 7 1.27,-1.27; 8 1.27,1.27; 9 3.81,-1.27; 10 3.81,1.27; 11 6.35,-1.27; 12 6.35,1.27; 13 8.89,-1.27; 14 8.89,1.27; 15 11.43,-1.27; 16 11.43,1.27
SOT23-BEC = smd 1 x 1.4: B -0.95,-1.1; C 0,1.1; E 0.95,-1.1
R0603 = smd 0.889 x 0.889: 1 -0.762,0; 2 0.762,0
OG-POTS_ALPS_POT_VERTICAL = drill 1 pad 1.88: P$1 -2.58,-6.7; P$2 0,-6.7; P$3 2.58,-6.7 | drill 2.2 pad 3.175: P$4 4.4,0; P$5 -4.4,0
M50-3600542 = smd 0.75 x 2.5: 1 -2.54,-1.81; 2 -2.54,2; 3 -1.27,-1.81; 4 -1.27,2; 5 0,-1.81; 6 0,2; 7 1.27,-1.81; 8 1.27,2; 9 2.54,-1.81; 10 2.54,2
B1,27 = smd 1.27 x 1.27: TP 0,0
QFN50P400X400X100-25N = smd 1.2 x 0.3: 1 -2.2,1.245; 2 -2.2,0.762; 3 -2.2,0.254; 4 -2.2,-0.254; 5 -2.2,-0.762; 6 -2.2,-1.245; 13 2.2,-1.245; 14 2.2,-0.762; 15 2.2,-0.254; 16 2.2,0.254; 17 2.2,0.762; 18 2.2,1.245 | smd 0.3 x 1.2: 7 -1.245,-2.2; 8 -0.762,-2.2; 9 -0.254,-2.2; 10 0.254,-2.2; 11 0.762,-2.2; 12 1.245,-2.2; 19 1.245,2.2; 20 0.762,2.2; 21 0.254,2.2; 22 -0.254,2.2 | smd 0.305 x 1.2: 23 -0.762,2.2; 24 -1.245,2.2 | smd 2.032 x 2.032: 25 0,0
SOT95P237X112-3N = smd 1.321 x 0.559: 1 -1.016,0.94; 2 -1.016,-0.94; 3 1.016,0
QFN50P250X350X100-17N = smd 0.305 x 0.813: 1 -0.254,1.702; 8 -0.254,-1.702; 9 0.254,-1.702; 16 0.254,1.702 | smd 0.813 x 0.305: 2 -1.194,1.245; 3 -1.194,0.762; 4 -1.194,0.254; 5 -1.194,-0.254; 6 -1.194,-0.762; 7 -1.194,-1.245; 10 1.194,-1.245; 11 1.194,-0.762; 12 1.194,-0.254; 13 1.194,0.254; 14 1.194,0.762; 15 1.194,1.245 | smd 1.143 x 2.159: 17 0,0
SOT95P290X145-5N = smd 1.27 x 0.559: 1 -1.295,0.94; 2 -1.295,0; 3 -1.295,-0.94; 4 1.295,-0.94; 5 1.295,0.94
SOIC8-N_MC = smd 1.981 x 0.559: 1 -2.362,1.905; 2 -2.362,0.635; 3 -2.362,-0.635; 4 -2.362,-1.905; 5 2.362,-1.905; 6 2.362,-0.635; 7 2.362,0.635; 8 2.362,1.905

### Placement (x,y rotation side)
B1  5.18,81.28 270 top
B2  30.58,81.28 270 top
B3  5.18,67.31 270 top
B4  30.58,67.31 270 top
C1  54.83,35.37 270 top
C2  29.31,25.4 180 top
C3  28.81,13.72 180 top
C4  11.53,89.53 180 top
C5  19.15,60.96 180 top
C6  7.63,59.41 90 top
C7  40.78,92.45 270 top
C8  15.97,42.3 270 top
C10  30.83,50.75 0 top
C11  4.65,41.49 270 top
C12  19.64,39.66 0 top
C13  2.02,41.5 90 top
C14  23.05,89.23 180 top
C15  39.08,41.37 90 top
C16  39.08,35.37 270 top
C17  52.81,38.8 270 top
C18  31.81,13.08 90 top
C19  32.06,26.66 270 top
C21  42.64,56.77 180 top
D1  13.44,26.67 90 top
D2  13.44,12.7 90 top
D24  [LED0603]  16.61,83.82 270 top
D25  [LED0603]  16.61,78.74 270 top
D26  [LED0603]  11.53,83.82 270 top
D27  [LED0603]  11.53,78.74 270 top
D28  [LED0603]  11.53,64.77 270 top
D29  [LED0603]  11.53,69.85 270 top
D30  [LED0603]  16.61,64.77 270 top
D31  [LED0603]  16.61,69.85 270 top
D32  [LED0603]  42.01,64.77 270 top
D33  [LED0603]  36.93,64.77 270 top
D34  [LED0603]  36.93,69.85 270 top
D35  [LED0603]  42.01,69.85 270 top
D36  [LED0603]  42.01,83.82 270 top
D37  [LED0603]  42.01,78.74 270 top
D38  [LED0603]  36.93,83.82 270 top
D39  [LED0603]  36.93,78.74 270 top
D40  [LED0603]  57.25,17.14 180 top
D41  [LED0603]  57.25,2.54 180 top
D42  [LED0603]  57.25,74.3 180 top
D43  [LED0603]  57.25,59.05 180 top
D44  [LED0603]  57.25,43.81 180 top
FID1  1.83,104 0 top
FID2  56.83,5 0 top
FID3  1.83,5 0 top
IC1  10.26,41.27 270 top
IC3  31.6,19.93 0 top
IC4  46.83,38.37 90 top
J1  6.45,10.16 0 top
J2  6.45,50.8 0 top
J3  6.45,30.48 0 top
J4  6.45,99.06 0 top
J5  36.93,99.06 0 top
J6  52.17,99.06 0 top
J7  52.17,24.13 0 top
J8  52.17,9.53 0 top
J9  52.17,81.28 0 top
J10  52.17,66.04 0 top
J11  52.17,50.8 0 top
J12  42.01,9.53 0 top
J13  42.01,24.13 0 top
J14  9.62,19.18 180 bottom
OUTLINE  -0.5,0 0 top
PRETTY1  30.33,4.1 0 bottom
Q1  29.56,100.97 180 top
Q2  3.28,90.17 180 top
Q3  55.59,31.81 180 top
Q4  35.66,1.91 90 top
Q5  44.27,103.53 0 top
Q6  54.58,89.5 0 top
Q7  42.64,59.69 0 top
Q8  53.45,42.98 0 top
R1  12.17,36.83 180 top
R2  52.83,35.37 90 top
R3  41.34,32.77 180 top
R4  32.25,8.17 0 top
R5  29.31,27.3 0 top
R6  34.54,13.87 0 top
R7  29.17,34.06 90 top
R8  29.7,11.04 0 top
R9  30.96,34.06 90 top
R10  52.33,17 180 top
R11  11.42,91.44 0 top
R12  41.08,41.37 270 top
R13  47.73,74.3 180 top
R14  13.44,6.35 90 top
R15  37.08,41.37 90 top
R16  14.07,48.9 90 top
R17  21.69,10.16 0 top
R18  30.7,104.78 180 top
R19  50.7,31.76 180 top
R20  28.67,94.61 270 top
R21  56.58,37 270 top
R22  41.08,35.37 90 top
R23  14.71,45.72 0 top
R24  38.03,16.83 180 top
R25  35.31,30.85 270 top
R26  15.34,60.96 180 top
R27  13.79,34.1 270 top
R28  37.08,35.37 270 top
R29  14.12,55.69 90 top
R30  14.07,3.17 0 top
R31  36.93,73.03 90 top
R32  37.61,67.19 0 top
R33  41.38,67.31 180 top
R34  42.01,73.03 90 top
R35  37.05,86.36 180 top
R36  37.86,81.22 0 top
R37  32.25,4.06 180 top
R38  44.55,2.54 180 top
R39  45.33,96 270 top
R40  43.66,95.99 90 top
R41  49.83,90.5 180 top
R42  50.83,88.25 0 top
R43  45.82,61.59 180 top
R44  47.09,57.78 180 top
R45  46.45,53.98 270 top
R46  44.77,44.5 0 top
R47  47.09,59.69 180 top
R48  44.77,46.25 180 top
R49  48.36,2.54 180 top
R50  34.43,59.45 270 top
R51  39.64,59.45 270 top
R52  34.39,27.94 0 top
R53  32.87,30.48 0 top
R54  41.38,81.28 180 top
R55  37.12,90.61 180 top
R56  12.17,86.36 0 top
R57  12.17,81.28 0 top
R58  15.67,81.22 180 top
R59  17.24,86.36 0 top
R60  7.09,89.53 0 top
R61  12.17,72.39 0 top
R62  12.17,67.31 0 top
R63  15.67,67.19 180 top
R64  17.24,72.39 0 top
R67  7.09,91.44 180 top
R68  21.69,50.8 0 top
R69  21.69,30.48 0 top
R70  21.69,99.06 0 top
SWD1  17.31,58.09 0 bottom
TP1  36.7,45 0 bottom
U1  37.58,50.25 0 top
U2  11.17,59.41 180 top
U3  44.13,89.64 90 top
U4  30.23,89.36 180 top
U5  22.34,85.17 0 top
U6  37.08,59.5 90 top
U7  29.31,40.91 270 top

### Tracks (layer width: path | path; a pad name or v marks a point on that pad's centre or on a via)
3.3V  (via drill 0.3)
  Top 0.254: IC1.2 IC1.4 15.72,41.27 C8.2 16.5,41.53 C12.+ 18.37,38.96 19.08,38.25 24.33,38.25 | U1.3 31.84,50.5 C10.2 31.59,50.99 v30.83,51.75 | C21.2 41.06,56.77 40.58,57.25 40.58,60 40.33,60.25 39.68,60.25 R51.1 39.06,60.8 U6.4 36.97,59.75 35.33,59.75 34.87,60.21 R50.1 34.4,60.25 33.58,60.25 29.7,56.38 | R60.2 C4.2 11.73,90.5 20.33,90.5 21.6,89.23 C14.2 | R70.P$3 25.76,93.85 R20.2 31.98,93.85 v32.08,93.75 | U5.16 22.59,88.92 C14.2 | C14.2 22.29,90.38 R70.P$3 | U3.16 v41.44,89.89 40.83,90.5 | 40.83,90.5 40.83,91.64 C7.2 | IC4.4 51.62,38.37 C17.1 52.83,39.62 55.2,39.62 55.2,39.75 55.39,39.94 | U4.16 29.98,86.85 v29.83,86.75 | v29.83,85.25 29.83,84.25 29.08,83.5 26.83,83.5 25.95,84.38 | U3.10 45.38,91.05 45.83,91.5 47.08,91.5 47.58,91 v47.58,89 47.58,86.75 57.95,76.38 57.95,74.38 D42.+ 58.08,74.25 58.08,59.12 D43.+ 58.08,59 58.08,43.88 D44.+ 57.95,43.75 57.95,42.5 55.39,39.94 | 40.83,90.5 39.33,92 34.33,92 v34.08,91.75 | R17.P$3 24.27,7.06 22.83,8.5 22.83,15.25 v24.33,16.75 | v24.33,19 24.33,23.72 R69.P$3 24.27,28.31 23.33,29.25 23.33,32 24.33,33 v24.33,33.75 | v24.33,36.25 24.33,38.25 | 24.33,38.25 24.33,40.12 | 24.33,40.12 v24.33,40.75 | 23.33,54.75 23.33,49.75 24.33,48.75 24.33,44.16 R68.P$3 | 23.33,54.75 v23.33,60.5 | v27.08,60.5 27.08,57.25 28.08,56.25 29.58,56.25 29.7,56.38 | R29.1 20.83,54.93 | 20.83,54.93 23.15,54.93 23.33,54.75 | v20.83,54.5 20.83,54.93 | 25.95,84.38 25.5,83.92 U5.10 23.58,83.88 v23.58,82.62 | 25.95,84.38 26.58,85 26.58,87.5 26.33,87.75 26.33,90.3 | 26.33,90.3 R70.P$3 | U4.10 26.64,90.61 26.33,90.3 | v30.08,56 29.7,56.38 | 24.33,40.12 v27.83,40.12 | U7.1 31.2,43.25 31.2,41.88 30.95,41.62 v29.33,41.62
  Top 0.254: v22.7,81.75 22.7,74.75 25.2,72.25 v25.2,60.38 | D41.+ 58.08,2.62 58.08,17.12 D40.+ 58.08,17.25 58.08,26.25 58.7,26.88 v58.7,36.62 | 55.39,39.94 v56.58,38.75
  Bottom 0.254: v29.83,86.75 v29.83,85.25 | v34.08,91.75 v32.08,93.75 | v24.33,16.75 v24.33,19 | v24.33,33.75 v24.33,36.25 | v23.33,60.5 25.2,60.5 | 25.2,60.5 v27.08,60.5 | SWD1.1 20.8,54.53 v20.83,54.5 | v24.33,40.75 24.33,44.04 R68.P$3 | v41.44,89.89 41.44,89.86 41.83,89.5 42.33,89 v47.58,89 | v27.83,40.12 v29.33,41.62 | v22.7,81.75 v23.58,82.62 | 25.2,60.5 v25.2,60.38 | v30.08,56 30.83,55.25 v30.83,51.75 | v56.58,38.75 v58.7,36.62
12V  (via drill 0.3)
  Top 0.381: C13.+ 4.15,40.23 C11.2 4.65,40.19 5.83,39 | 5.83,39 7.09,39 IC1.3 | 31.6,19 IC3.4 31.6,14.05 C18.2 31.99,13.84 33.08,12.75 33.08,10.75 v31.83,9.5 | 31.6,19 31.6,19.77 31.83,20 37.58,20 46.33,28.75 46.33,29.75 47.45,30.88 | 47.45,30.88 48.33,31.75 R19.2 | v31.83,6.5 31.83,4.4 R37.2 | 5.83,39 3.33,36.5 3.33,34.5 4.83,33 11.58,33 13.44,31.14 D1.2 14.41,28.67 15.58,27.5 15.58,23.5 16.83,22.25 21.83,22.25 v23.08,21 | R41.2 49.07,91.88 | 49.07,91.88 49.07,93.76 47.83,95 | 47.83,95 45.57,95 R39.2 | v30.58,19 31.6,19 | R11.2 14.02,91.44 18.83,96.25 27.33,96.25 v28.58,97.5 | v30.58,97.5 30.83,97.5 32.08,96.25 34.08,96.25 35.33,97.5 38.58,97.5 40.08,96 41.58,96 v42.08,96.5 | v47.33,95.5 47.83,95 | v45.2,58 45.2,53.88 45.83,53.25 46.45,53.25 R45.2 v46.45,46.88 | R43.2 45.08,61.62 45.2,61.75 v45.2,62.5 v45.2,64.88 | v46.2,33.5 v46.2,42 | 47.45,30.88 v46.2,32.12 | v46.08,73.25 v46.08,65.75 | v46.83,90.88 v46.83,77.12 | 49.07,91.88 v47.83,91.88
  Bottom 0.381: v31.83,9.5 v31.83,6.5 | v23.08,21 24.33,21 26.33,19 v30.58,19 | v28.58,97.5 v30.58,97.5 | v42.08,96.5 46.33,96.5 v47.33,95.5 | v45.2,62.5 v45.2,58 | v46.45,46.88 46.45,42.25 v46.2,42 | v46.2,32.12 v46.2,33.5 | v46.08,65.75 v45.2,64.88 | v46.08,73.25 46.08,76.38 v46.83,77.12 | v47.83,91.88 v46.83,90.88
-12V  (via drill 0.3)
  Top 0.381: C19.2 31.6,25.44 IC3.11 31.6,21.77 v30.33,20.5 | C5.- R26.1 15.96,60.88 15.96,60.25 14.71,59 13.58,59 13.33,58.75 13.33,57.5 v11.96,56.12 | v9.46,53.62 0.83,45 0.83,15.75 10.08,6.5 v11.33,6.5 | v13.08,8.25 13.44,9.61 D2.1 14.28,10.7 18.08,14.5 20.83,14.5 v26.83,20.5
  Bottom 0.381: v26.83,20.5 v30.33,20.5 | v9.46,53.62 v11.96,56.12 | v11.33,6.5 v13.08,8.25
ADC_IN1
  Top 0.203: U1.15 41.58,50 42.08,49.5 42.08,42.5 42.41,42.17 | IC4.8 42.41,42.17 | 42.41,42.17 41.13,42.17 R12.1 C15.2
ADC_IN2
  Top 0.203: U1.16 41.83,50.5 42.58,49.75 42.58,43.75 43.08,43.25 45.83,43.25 46.83,42.25 46.83,35.25 47.58,34.5 49.38,34.5 IC4.1 52.78,34.55 R2.1 C1.2
ADC_INTENSITY  (via drill 0.3)
  Top 0.203: C16.2 R22.1 44.18,34.6 IC4.14 43.83,34.16 v43.83,33.5 | U1.21 37.83,54.25 37.77,54.31 v37.7,54.25 | v39.83,47.62 39.83,44.5 v40.83,43.5
  Bottom 0.203: v39.83,47.62 39.83,52.12 v37.7,54.25 | v40.83,43.5 40.83,36.5 v43.83,33.5
BUTTON_ALGO  (via drill 0.3)
  Top 0.203: U1.9 37.33,46 36.58,45.25 33.08,45.25 31.83,46.5 28.58,46.5 27.33,47.75 v27.33,48 | B1.1 B1.4 7.34,74.51 6.08,73.25 6.08,57.75 6.83,57 8.33,57 15.08,50.25 15.08,49.25 16.33,48 v23.58,48
  Bottom 0.203: v23.58,48 v27.33,48
BUTTON_BEATS  (via drill 0.3)
  Top 0.203: v28.33,57.25 32.83,61.75 32.83,63.28 B4.4 B4.1 | v25.08,54.75 25.33,54.75 28.33,51.75 28.33,49.75 29.08,49.01 30.33,49.01 30.45,48.88 32.7,48.88 32.83,49 U1.6
  Bottom 0.203: v25.08,54.75 27.58,57.25 v28.33,57.25
BUTTON_SCALE
  Top 0.203: B3.1 B3.4 8.46,62.25 19.08,62.25 19.83,63 23.08,63 24.58,61.5 24.58,56.25 28.83,52 28.83,50 29.34,49.49 29.35,49.5 30.58,49.5 30.7,49.38 32.58,49.38 32.69,49.49 U1.5
BUTTON_TPB  (via drill 0.3)
  Top 0.203: U1.20 38.34,54.49 37.58,55.25 28.08,55.25 26.58,56.75 26.58,60.12 25.83,60.88 25.83,72.25 v29.58,76 | B2.1 B2.4
  Bottom 0.203: B2.4 31.4,76 v29.58,76
CLOCK  (via drill 0.3)
  Top 0.203: v25.58,87.88 25.95,87.5 25.95,85.25 25.08,84.38 23.58,84.38 U5.11 | v26.95,89.25 27.83,90.12 28.95,90.12 U4.11 | v45.08,91.75 44.83,91.5 44.83,90.88 U3.11 | v40.58,89.88 40.33,89.88 38.7,91.5 34.7,91.5 34.33,91.12 32.45,91.12 v32.33,91.25 | v34.2,51.75 34.45,51.5 35.33,51.5 U1.1 | v31.95,57.62 v33.7,55.88 | v29.7,59.88 29.7,74.38 v29.33,74.75 | v28.2,75.88 27.2,76.88 27.2,78.12 v28.08,79 | v31.7,82.62 31.7,84.12 31.58,84.25 31.58,87.25 v31.7,87.38
  Bottom 0.203: v26.95,89.25 26.64,88.94 | 26.64,88.94 v25.58,87.88 | v45.08,91.75 42.45,91.75 v40.58,89.88 | v32.33,91.25 31.7,91.25 29.77,89.31 | 29.77,89.31 29.33,88.88 26.7,88.88 26.64,88.94 | v34.2,51.75 34.2,55.38 v33.7,55.88 | v29.7,59.88 v31.95,57.62 | v28.2,75.88 v29.33,74.75 | v31.7,82.62 v28.08,79 | 29.77,89.31 v31.7,87.38
CLOCK_IN  (via drill 0.3)
  Top 0.203: Q2.C 5.83,89.07 | 5.83,89.07 5.86,89.07 R60.1 | v41.2,49.38 41.08,49.5 39.83,49.5 U1.14 | v36.45,56.38 35.45,56.38 v33.08,58.75 | v26.45,61.75 v29.08,61.75 | v23.08,65.12 17.45,65.12 17.08,64.75 11.08,64.75 8.46,67.38 8.46,86.38 5.83,89 5.83,89.07
  Bottom 0.203: v41.2,49.38 41.2,51.62 v36.45,56.38 | v33.08,58.75 33.08,59.38 30.7,61.75 v29.08,61.75 | v23.08,65.12 v26.45,61.75
CPU_RESET  (via drill 0.3)
  Top 0.203: U1.23 36.82,53.26 36.58,53.5 v29.58,53.5 | v14.08,58 14.12,57.97 R29.2 13.53,56.45 12.83,55.75 12.83,54.25 13.58,53.5 v22.58,53.5
  Bottom 0.203: v22.58,53.5 v29.58,53.5 | SWD1.10 14.77,58.69 v14.08,58
D21
  Top 0.203: R47.1 49.39,59.69 50.08,59 56.43,59 D43.-
DACCS  (via drill 0.3)
  Top 0.203: U1.7 36.34,47.26 35.33,46.25 32.83,46.25 32.08,47 30.33,47 v30.08,47.25 | v29.83,44.75 29.83,43.39 U7.2
  Bottom 0.203: v30.08,47.25 30.08,45 v29.83,44.75
DACSCK
  Top 0.203: U1.12 38.82,45.24 37.33,43.75 36.33,43.75 33.58,41 29.08,41 28.67,41.41 U7.3
DACSDI
  Top 0.203: U1.11 38.34,45.51 37.08,44.25 32.58,44.25 31.33,45.5 28.33,45.5 27.41,44.58 U7.4
GND  (via drill 0.3)
  Top 0.254: U1.25 37.33,50 U1.4 32.45,50 32.33,49.88 30.94,49.88 C10.1 29.57,51.49 v29.58,51.5 | U7.7 29.95,36.88 v30.08,36.75 | U7.5 26.88,38.55 v26.58,38.25 | C12.- 22.17,39.66 v22.33,39.5 | C8.1 17.02,43.06 v17.08,43 | C11.1 3.58,42.25 v3.33,42.5 3.06,42.77 C13.- | IC1.1 5.91,43.58 v5.58,43.5 | Q2.E 1.35,91.27 v1.33,91.25 | C4.1 13.29,89.53 v13.33,89.5 | Q1.E 28.61,102.72 v28.08,103.25 | U3.8 44.38,89.39 U3.17 43.88,89.89 U3.13 43.88,93.2 v43.83,93.5 | U4.13 29.98,89.11 U4.17 30.49,89.62 U4.8 30.65,91.07 v31.33,91.75 | U5.8 22.09,84.91 U5.17 22.59,85.42 U5.13 24.25,85.42 25.33,86.5 v25.33,86.75 | Q5.E 46.15,102.43 v46.33,102.25 | C7.1 40.29,93.21 v40.08,93 | Q7.E 43.58,58.58 v43.58,57.5 43.58,56.94 C21.1 | Q8.E 55.08,41.2 v55.08,41 | C17.2 52.85,38 v53.58,38 53.7,38 | IC4.3 49.52,37 v50.83,37 | IC4.6 50.73,40.91 v50.83,41 | IC4.10 IC4.11 IC4.12 42.98,37.09 v42.83,37.25 | Q4.E 37.43,2.85 v37.83,3.25 | C18.1 31.81,11.52 v31.83,11.5 | IC3.5 32.87,16.04 v32.83,15.75 | IC3.3 v30.33,15.75 | IC3.12 v30.33,24 | IC3.10 32.87,23.96 v32.83,24 | C19.1 32.06,27.98 v32.08,28.25 | C5.+ 20.42,61.91 v20.33,62 | U2.1 12.18,57.85 v11.83,57.5 | C6.1 7.63,57.95 v7.83,57.75 | Q6.E 56.43,88.4 v56.58,88.25 | C14.1 24.08,89.5 v24.08,90 | U6.2 v37.08,59 | U6.5 36.14,61.19 v35.83,61.5 | v53.7,33.88 54.58,33 Q3.E | D27.- 11.53,77.55 v11.83,77.25 | D26.- 11.39,83.06 v10.83,82.5 | D24.- 16.61,83.03 v16.08,82.5 | D25.- 16.61,77.72 v17.08,77.25 | D29.- 11.17,69.09 v10.83,68.75 | D31.- 15.92,69.09 v15.83,69 | D30.- v17.32,64.01 v17.33,64 | D28.- v10.84,64.01 v10.83,64 | D37.- 41.35,77.98 v41.33,78 | D36.- 41.39,83.06 v41.33,83 | D38.- 37.52,83.06 v37.58,83
  Top 0.254: D39.- 37.56,77.98 v37.58,78 | D34.- 36.17,69.09 v36.08,69 | D35.- 41.42,69.09 v41.33,69 | D33.- v36.34,64.01 v36.33,64 | D32.- v41.34,64.01 v41.33,64
  Bottom 0.254: v30.08,36.75 30.08,36.5 | v26.58,38.25 26.33,38.25 | v22.33,39.5 22.33,39.25 | v17.08,43 17.08,42.75 | v3.33,42.5 3.33,43 | v1.33,91.25 1.33,90.75 | v13.33,89.5 13.33,89.25 | v28.08,103.25 28.08,103.5 | v46.33,102.25 46.58,102.5 | v40.08,93 39.58,93 | v43.58,57.5 43.08,57.5 | v55.08,41 55.33,40.75 | v50.83,41 51.08,41 | v42.83,37.25 42.83,37.5 | v37.83,3.25 38.33,3.25 | v31.83,11.5 32.08,11.25 | v32.83,15.75 33.08,15.5 | v30.33,15.75 30.33,15.5 | v30.33,24 30.58,24 | v32.83,24 33.08,24 | v32.08,28.25 32.08,28.5 | v20.33,62 20.33,62.25 | v11.83,57.5 11.58,57.5 | v7.83,57.75 8.33,57.75 | v56.58,88.25 56.83,88.25 | v24.08,90 24.33,90 | v29.58,51.5 29.58,51.75 | v35.83,61.5 35.58,61.75 | 25.08,86.5 v25.33,86.75 | v31.33,91.75 31.83,91.75 | v11.83,77.25 11.58,77 | v10.83,82.5 10.58,82.5 | v16.08,82.5 15.83,82.5 | v17.08,77.25 17.33,77.25 | v10.83,68.75 10.58,68.75 | v15.83,69 15.83,68.75 | v17.33,64 17.58,64 | v10.83,64 10.58,64 | v41.33,78 41.08,78 | v41.33,83 41.08,83 | v37.58,83 37.83,83 | v37.58,78 37.83,78 | v36.08,69 35.83,69 | v41.33,69 41.08,69 | v36.33,64 36.08,64 | v41.33,64 41.08,64
  pour Bottom: -1.17,109.22 -1.17,-2.54 62.33,-2.54 62.33,109.22
KNOB_IN1
  Top 0.203: R23.2 20.07,45.72 R68.P$2
KNOB_IN2
  Top 0.203: R27.2 19.74,33.34 21.58,31.5 21.58,23.89 R69.P$2
KNOB_INTENSITY
  Top 0.203: R30.2 15.26,3.17 17.33,5.25 19.9,5.25 R17.P$2
KNOB_TEMPO  (via drill 0.3)
  Top 0.203: v22.83,62.38 23.95,61.25 23.95,50.25 28.2,46 31.45,46 32.7,44.75 36.7,44.75 37.83,45.88 37.83,48 U1.10 | v23.7,63.25 23.7,73.12 21.33,75.5 v21.33,83.25 | v19.95,91.12 21.2,92.38 21.58,92.38 R70.P$2
  Bottom 0.203: v23.7,63.25 v22.83,62.38 | v21.33,83.25 21.33,87.62 19.95,89 v19.95,91.12
LATCH  (via drill 0.3)
  Top 0.203: v27.2,87.5 27.2,88.62 v28.08,89.5 28.2,89.62 U4.12 | v29.08,91.5 30.58,93 37.58,93 39.45,94.88 41.95,94.88 42.45,94.38 43.83,94.38 44.45,93.75 44.45,93 44.38,92.93 U3.12 | v33.08,57.38 34.7,55.75 37.7,55.75 38.83,54.62 38.83,52.5 U1.19 | U5.12 24.74,84.91 v25.33,85.5 | v24.95,81 26.95,81 30.2,77.75 30.2,61.38 v30.45,61.12
  Bottom 0.203: v27.2,87.5 27.2,87.38 v25.33,85.5 25.08,85.25 25.08,82.38 24.95,82.25 v24.95,81 | v29.08,91.5 29.08,90.5 v28.08,89.5 | v30.45,61.12 30.45,60.25 v33.08,57.38
N$1  (via drill 0.3)
  Top 0.203: U4.1 30.92,87.66 31.08,87.5 31.08,82.25 v32.08,81.25 | v33.58,81.25 33.58,79.5 34.58,78.5 34.58,75.75 35.33,75 37.58,75 38.08,74.5 38.08,67.49 R32.2
  Bottom 0.203: v32.08,81.25 v33.58,81.25
N$2
  Top 0.203: IC3.6 34.14,14.23 R6.1 33.83,13.81 33.83,9.75 33.01,8.93 R4.2
N$3
  Top 0.203: R16.2 14.07,50.26 9.33,55 6.75,55 J2.TIP@3
N$4
  Top 0.203: IC4.9 41.38,40.91 R12.2 C15.1 37.2,40.6 | 37.2,40.6 R15.1 | R16.1 14.07,45.85 | 14.07,45.85 R23.1 | 14.07,45.85 14.07,45.26 15.08,44.25 16.83,44.25 19.7,41.38 27.45,41.38 28.83,40 36.6,40 37.2,40.6
N$5
  Top 0.203: U7.8 31.21,35.07 R9.2
N$6
  Top 0.203: J3.TIP@3 9.55,34.98 R1.2
N$7
  Top 0.203: U7.6 28.67,36.66 29.08,36.25 29.08,34.92 R7.2
N$8  (via drill 0.3)
  Top 0.203: C1.1 R2.2 52.53,35.83 IC4.2 49.35,35.75 v47.58,35.75 | R1.1 12.93,35.73 R27.1 25.46,34.87 v27.33,33 | v47.08,33.5 46.34,32.77 R3.1 42.11,32.28 41.58,31.75 39.58,31.75 39.08,32.25 37.08,32.25 36.33,33 32.83,33 v31.83,32
  Bottom 0.203: v47.08,33.5 47.08,35.25 v47.58,35.75 | v31.83,32 28.33,32 v27.33,33
N$9  (via drill 0.3)
  Top 0.203: IC3.13 29.06,24.39 C2.1 R5.2 30.07,28.24 v30.58,28.75 | v30.58,31.25 30.58,32.91 R9.1
  Bottom 0.203: v30.58,28.75 v30.58,31.25
N$10
  Top 0.203: IC3.2 29.06,16.25 | 29.06,16.25 29.06,14.23 C3.1 29.57,11.93 R8.2 | R7.1 29.17,29.84 27.08,27.75 27.08,21.38 29.08,19.38 29.08,16.27 29.06,16.25
N$12
  Top 0.203: R13.1 D42.-
N$13
  Top 0.381: J14.10 J14.9 D1.1
N$14
  Top 0.203: R24.2 36.77,17.34 IC3.7 35.41,13.97 R6.2
N$15
  Top 0.203: Q1.B 30.51,104.2 R18.2
N$16
  Top 0.203: R18.1 35.71,104.78 J5.TIP@3
N$17
  Top 0.203: R53.2 R52.1 34.14,27.43 IC3.9
N$18
  Top 0.203: IC3.1 27.79,13.98 C3.2 28.05,11.93 R8.1 28.93,10.72 R4.1
N$19
  Top 0.203: R33.2 39.83,68.09 39.83,74.75 38.83,75.75 36.58,75.75 35.33,77 35.33,84.25 34.33,85.25 34.33,86.25 32.46,88.12 U4.2
N$20
  Top 0.203: R25.1 39.03,31.61 J13.TIP@3
N$21
  Top 0.203: R24.1 39.2,16.83 J12.TIP@3
N$23
  Top 0.203: R10.1 56.34,17 D40.-
N$24
  Top 0.203: IC3.14 27.79,24.64 C2.2 R5.1 28.55,27.97 31.08,30.5 32.09,30.5 R53.1
N$25
  Top 0.203: R21.2 56.58,32.95 Q3.B
N$26
  Top 0.203: U4.3 32.98,88.6 35.08,86.5 35.08,85.5 35.83,84.75 35.83,77.25 36.58,76.5 39.3,76.5 R34.2
N$27
  Top 0.203: U4.4 33.53,89.11 R35.2
N$28
  Top 0.203: R62.1 11.4,65.66 D28.+
N$29
  Top 0.203: R19.1 51.46,29.34 J7.TIP@3 54.25,30.71 Q3.C
N$30
  Top 0.203: U4.5 34.71,89.62 35.58,88.75 38.58,88.75 39.58,87.75 39.58,82.17 R36.2
N$31
  Top 0.203: U4.6 34.95,90.13 35.58,89.5 38.83,89.5 40.33,88 40.33,81.56 R54.2
N$32
  Top 0.203: R61.1 11.4,70.74 D29.+
N$33
  Top 0.203: R14.2 13.3,7.25 12.08,7.25 11.83,7.5 11.83,12.75 10.33,14.25 5.83,14.25 6.24,14.66 J1.TIP@3
N$34  (via drill 0.3)
  Top 0.203: R28.1 38.2,36.13 | 38.2,36.13 C16.1 39.21,36 41.33,36 | 41.33,36 41.2,36.13 R22.2 41.38,35.83 IC4.13 | 41.33,36 41.58,36 | R30.1 13.44,3.3 R14.1 13.46,5.62 15.46,5.62 v22.2,12.38 | v23.45,13.62 23.45,14.88 27.83,19.25 v27.83,19.75 | v29.58,19.75 30.7,19.75 32.08,21.12 35.83,21.12 36.7,22 v36.7,31 | v39.08,33.38 38.2,34.25 38.2,36.13
  Bottom 0.203: v23.45,13.62 v22.2,12.38 | v29.58,19.75 v27.83,19.75 | v39.08,33.38 v36.7,31
N$35
  Top 0.203: U4.7 34.11,90.61 R55.2
N$36
  Top 0.203: U4.15 29.04,86.29 29.33,86 30.33,86 30.58,85.75 30.58,81 31.33,80.25 31.33,75.25 32.58,74 36.72,74 R31.2
N$37  (via drill 0.3)
  Top 0.203: U5.15 23.53,87.8 v23.33,88 | v20.58,89.25 15.82,89.25 R56.2
  Bottom 0.203: v23.33,88 21.83,88 v20.58,89.25
N$38
  Top 0.203: U5.1 21.71,86.87 19.83,88.75 16.33,88.75 14.08,86.5 14.08,82.43 R57.2
N$39
  Top 0.203: U5.2 21.15,86.43 19.58,88 16.58,88 14.83,86.25 14.83,81.29 R58.2
N$40
  Top 0.203: U5.3 18.44,85.93 R59.2
N$41
  Top 0.203: U5.4 19,85.42 18.58,85 18.58,77.5 16.58,75.5 14.08,75.5 13.08,74.5 13.08,72.54 R61.2
N$42
  Top 0.203: U5.5 19.24,84.91 19.08,84.75 19.08,77.25 16.83,75 14.58,75 14.08,74.5 14.08,68.46 R62.2
N$43
  Top 0.203: J4.TIP@3 6.45,99.13 9.33,96.25 9.33,92.92 R67.1
N$44
  Top 0.203: R49.1 D41.-
N$45
  Top 0.203: R48.1 49.08,46.25 52.33,43 55.67,43 D44.-
N$48
  Top 0.203: U5.6 19.73,84.4 19.58,84.25 19.58,77 17.08,74.5 15.08,74.5 14.83,74.25 14.83,67.26 R63.2
N$49
  Top 0.203: U5.7 20.25,83.92 20.08,83.75 20.08,76.75 17.58,74.25 17.58,72.82 R64.2
N$57
  Top 0.203: R38.2 38.34,2.54 Q4.B
N$58
  Top 0.203: R37.1 34.56,2.52 Q4.C 34.56,2.73 35.83,4 46.58,4 52.08,9.5 52.08,13.94 J8.TIP@3
N$60
  Top 0.203: R40.2 43.66,102.1 Q5.B
N$61
  Top 0.203: J6.TIP@3 51.1,104.63 Q5.C 44.27,97.82 R39.1
N$63
  Top 0.203: Q6.B 51.74,88.4 R42.2
N$64
  Top 0.381: D2.2 11.88,16.25 4.58,16.25 3.28,17.55 J14.2 J14.1
N$65
  Top 0.203: R41.1 54.48,90.5 Q6.C 54.68,90.5 56.58,90.5 57.83,89.25 57.83,87 56.61,85.78 J9.TIP@3
N$66
  Top 0.203: R67.2 4.4,91.44 Q2.B
N$68
  Top 0.203: R44.2 46.3,57.78 44.33,59.75 42.85,59.75 Q7.B
N$69
  Top 0.203: Q7.C 43.79,60.79 44.08,60.5 45.49,60.5 R43.1 52.08,66 J10.TIP@3
N$71
  Top 0.203: Q8.B 49.88,44.5 R46.2
N$72
  Top 0.203: Q8.C 54.83,45.47 54.83,48.25 52.17,50.91 J11.TIP@3 47.02,55.3 R45.1
N$73
  Top 0.203: R57.1 11.4,79.63 D27.+
N$74
  Top 0.203: R56.1 11.4,84.71 D26.+
N$75
  Top 0.203: R58.1 16.48,79.63 D25.+
N$76
  Top 0.203: R59.1 16.48,84.71 D24.+
N$77
  Top 0.203: R63.1 16.48,65.66 D30.+
N$78
  Top 0.203: R64.1 16.48,70.74 D31.+
N$79
  Top 0.203: D32.+ 42.01,67.18 R33.1
N$80
  Top 0.203: D33.+ 36.93,67.11 R32.1
N$81
  Top 0.203: D34.+ R31.1
N$82
  Top 0.203: D35.+ R34.1
N$83
  Top 0.203: R55.1 38.97,90.61 41.83,87.75 41.83,84.76 D36.+
N$84
  Top 0.203: R54.1 42.14,79.63 D37.+
N$85
  Top 0.203: D38.+ 36.93,85.48 R35.1
N$86
  Top 0.203: R36.1 37.06,79.63 D39.+
N$94
  Top 0.203: IC3.8 35.41,27.68 R52.2 35.15,29.93 R25.2
N$96
  Top 0.203: R11.1 10.65,98.56 J4.SWITCH@3
N$97
  Top 0.203: IC4.7 51.16,42.17 51.58,41.75 51.58,40 51.21,39.63 IC4.5
OUT_ACCENT  (via drill 0.3)
  Top 0.203: v46.08,78.75 46.08,84.88 43.83,87.12 43.83,88.38 U3.4 | v57.33,75.88 v48.95,75.88 | v58.95,40.25 v58.95,74.25 | R21.1 56.58,37.88 57.33,37.88 57.45,37.75 | v57.45,40.25 57.45,37.75 | 57.45,37.75 57.45,30.88 49.95,23.38 49.95,20 51.45,18.5 51.45,17 R10.2
  Bottom 0.203: v48.95,75.88 v46.08,78.75 | v58.95,74.25 v57.33,75.88 | v57.45,40.25 v58.95,40.25
OUT_BEAT  (via drill 0.3)
  Top 0.203: R44.1 46.33,59.31 R47.2 46.33,59.75 46.33,60.12 v48.58,62.38 | U3.2 42.88,86.69 44.33,85.25 44.33,81.75 44.2,81.62 v44.2,76.25 | v44.7,66.25 v47.7,63.25 | v43.45,75.25 v43.45,67.5
  Bottom 0.203: v47.7,63.25 v48.58,62.38 | v43.45,67.5 v44.7,66.25 | v43.45,75.25 43.45,75.5 v44.2,76.25
OUT_CLOCK  (via drill 0.3)
  Top 0.203: R40.1 42.85,95.23 v42.83,95 | v41.83,93.5 42.88,92.44 U3.15
  Bottom 0.203: v42.83,95 42.83,94.5 v41.83,93.5
OUT_GATE  (via drill 0.3)
  Top 0.203: R49.2 45.95,2.54 | 45.95,2.54 R38.1 | v46.08,85.75 44.45,87.38 44.45,88.38 U3.5 | v45.45,84.38 45.45,77.62 v47.2,75.88 | v49.45,73.62 51.83,73.62 57.2,68.25 v57.2,42.62 | v58.08,41.75 58.08,26.88 57.2,26 57.2,13.88 45.95,2.62 45.95,2.54
  Bottom 0.203: v46.08,85.75 45.45,85.12 v45.45,84.38 | v49.45,73.62 v47.2,75.88 | v58.08,41.75 v57.2,42.62
OUT_LOOP  (via drill 0.3)
  Top 0.203: R46.1 R48.2 44.08,46.25 44.08,46.75 44.58,47.25 44.58,56.5 44.45,56.62 v44.45,56.88 | U3.3 43.37,86.96 44.83,85.5 v44.83,75.62 | v44.08,74.62 v44.08,61.38
  Bottom 0.203: v44.08,61.38 44.58,60.88 44.58,57 v44.45,56.88 | v44.08,74.62 44.08,74.88 v44.83,75.62
OUT_TICK  (via drill 0.3)
  Top 0.203: 46.58,74.38 46.95,74.38 R13.2 46.58,74.38 | 46.58,74.38 45.2,74.38 43.58,76 43.58,84.25 42.33,85.5 42.33,89.38 U3.1 | v50.95,84.25 49.95,85.25 49.95,88.25 R42.1 | v49.95,83.25 49.95,77.75 46.58,74.38
  Bottom 0.203: v49.95,83.25 v50.95,84.25
PTA6  (via drill 0.3)
  Top 0.203: U1.8 36.82,46.49 v36.58,46.25
  Bottom 0.203: v36.58,46.25 36.7,46.12 TP1.TP
REF_-5V  (via drill 0.3)
  Top 0.203: C6.2 11.21,60.17 | 11.21,60.17 12,60.17 U2.2 13.97,60.35 R26.2 | v35.45,39.38 35.45,35.75 36.58,34.62 37.08,34.62 R28.2 37.08,33.62 37.94,32.77 R3.2 | R15.2 36.7,42.12 v35.45,40.88 35.08,40.5 28.95,40.5 27.58,41.88 24.58,41.88 22.95,43.5 22.95,44.75 20.45,47.25 v20.45,47.38 | 11.21,60.17 11.21,55 13.46,52.75 18.2,52.75 19.2,51.75 v19.2,48.62
  Bottom 0.203: v35.45,39.38 v35.45,40.88 | v20.45,47.38 v19.2,48.62
RESET_PATTERN  (via drill 0.3)
  Top 0.203: Q1.C 29.56,97.25 | 29.56,97.25 29.56,96.26 R20.1 | v41.2,48.5 40.7,49 39.83,49 U1.13 | v42.95,50.25 42.95,51.5 43.08,51.62 43.08,54.12 v39.58,57.62 | v39.58,61.25 39.58,67.75 38.58,68.75 v38.58,75.12 | v40.08,76.62 40.08,80.5 v39.58,81 | v38.33,82.25 38.33,85.62 38.58,85.88 v38.58,87.88 | v32.95,93.88 29.58,97.25 29.56,97.25
  Bottom 0.203: v42.95,50.25 v41.2,48.5 | v39.58,61.25 v39.58,57.62 | v40.08,76.62 v38.58,75.12 | v38.33,82.25 v39.58,81 | v38.58,87.88 38.58,88.25 v32.95,93.88
SCL
  Top 0.203: U1.17 41.84,51.01 42.58,51.75 42.58,53.75 41.83,54.5 39.83,54.5 37.08,57.25 36.58,57.25 36.08,57.75 36.08,58.14 U6.1 35.12,58.2 34.83,58.5 34.62,58.5 R50.2
SDA  (via drill 0.3)
  Top 0.203: U1.18 41.57,51.49 42.08,52 42.08,53.5 41.58,54 40.33,54 v40.08,53.75 | v40.08,55.25 39.83,55.25 38.08,57 38.08,58.14 U6.3 39.16,58.2 R51.2
  Bottom 0.203: v40.08,53.75 v40.08,55.25
SHIFTER1TO2  (via drill 0.3)
  Top 0.203: U5.9 22.59,82.75 23.34,82 v26.33,82 | U4.14 28.18,88.6 27.83,88.25 27.83,87 27.08,86.25 v27.08,84.25
  Bottom 0.203: v27.08,84.25 27.08,82.75 v26.33,82
SHIFTER2TO3
  Top 0.203: U4.9 29.98,91.65 30.83,92.5 37.83,92.5 39.7,94.38 41.83,94.38 43.37,92.84 U3.14
SHIFTERS  (via drill 0.3)
  Top 0.203: U1.2 35.37,51 32.83,51 v32.08,51.75 | U5.14 24.01,85.93 24.45,86.38 v24.45,87.25 | v33.08,60.62 v30.2,57.75 | v24.45,82.75 27.95,82.75 30.83,79.88 30.83,62.88 v31.95,61.75
  Bottom 0.203: v24.45,87.25 v24.45,82.75 | v32.08,51.75 32.08,55.88 v30.2,57.75 | v31.95,61.75 v33.08,60.62
SWD_CLK  (via drill 0.3)
  Top 0.203: U1.22 37.33,53.75 36.58,54.5 27.83,54.5 25.58,56.75 25.58,57.5 v25.83,57.5
  Bottom 0.203: 18.58,59.75 SWD1.4 18.58,58.5 19.08,58 24.33,58 25.08,57.25 25.83,57.25 v25.83,57.5
SWD_DIO  (via drill 0.3)
  Top 0.203: U1.24 29.13,52.45 25.08,56.5 25.08,58.5 v25.33,58.75
  Bottom 0.203: v25.33,58.75 25.08,59 20.58,59 19.85,59.73 SWD1.2